# Altium schematic sheet RK3568-SOM-Eth.SchDoc: Ethernet PHY with RJ45 connector
size A2; Date: Not used; ApprovedBy: Not used; CheckedBy: Not used; Author: Not used; CompanyName: STMicroelectronics; DrawnBy: Not used; Engineer: Not used; Organization: Not used; Address1: Not used; Address2: Not used; Address3: Not used; Address4: Not used; DocumentNumber: 6; Revision: Not used; SheetNumber: 6; SheetTotal: 9; Time: Not used; ImagePath: Not used; Application_BuildNumber: Not used
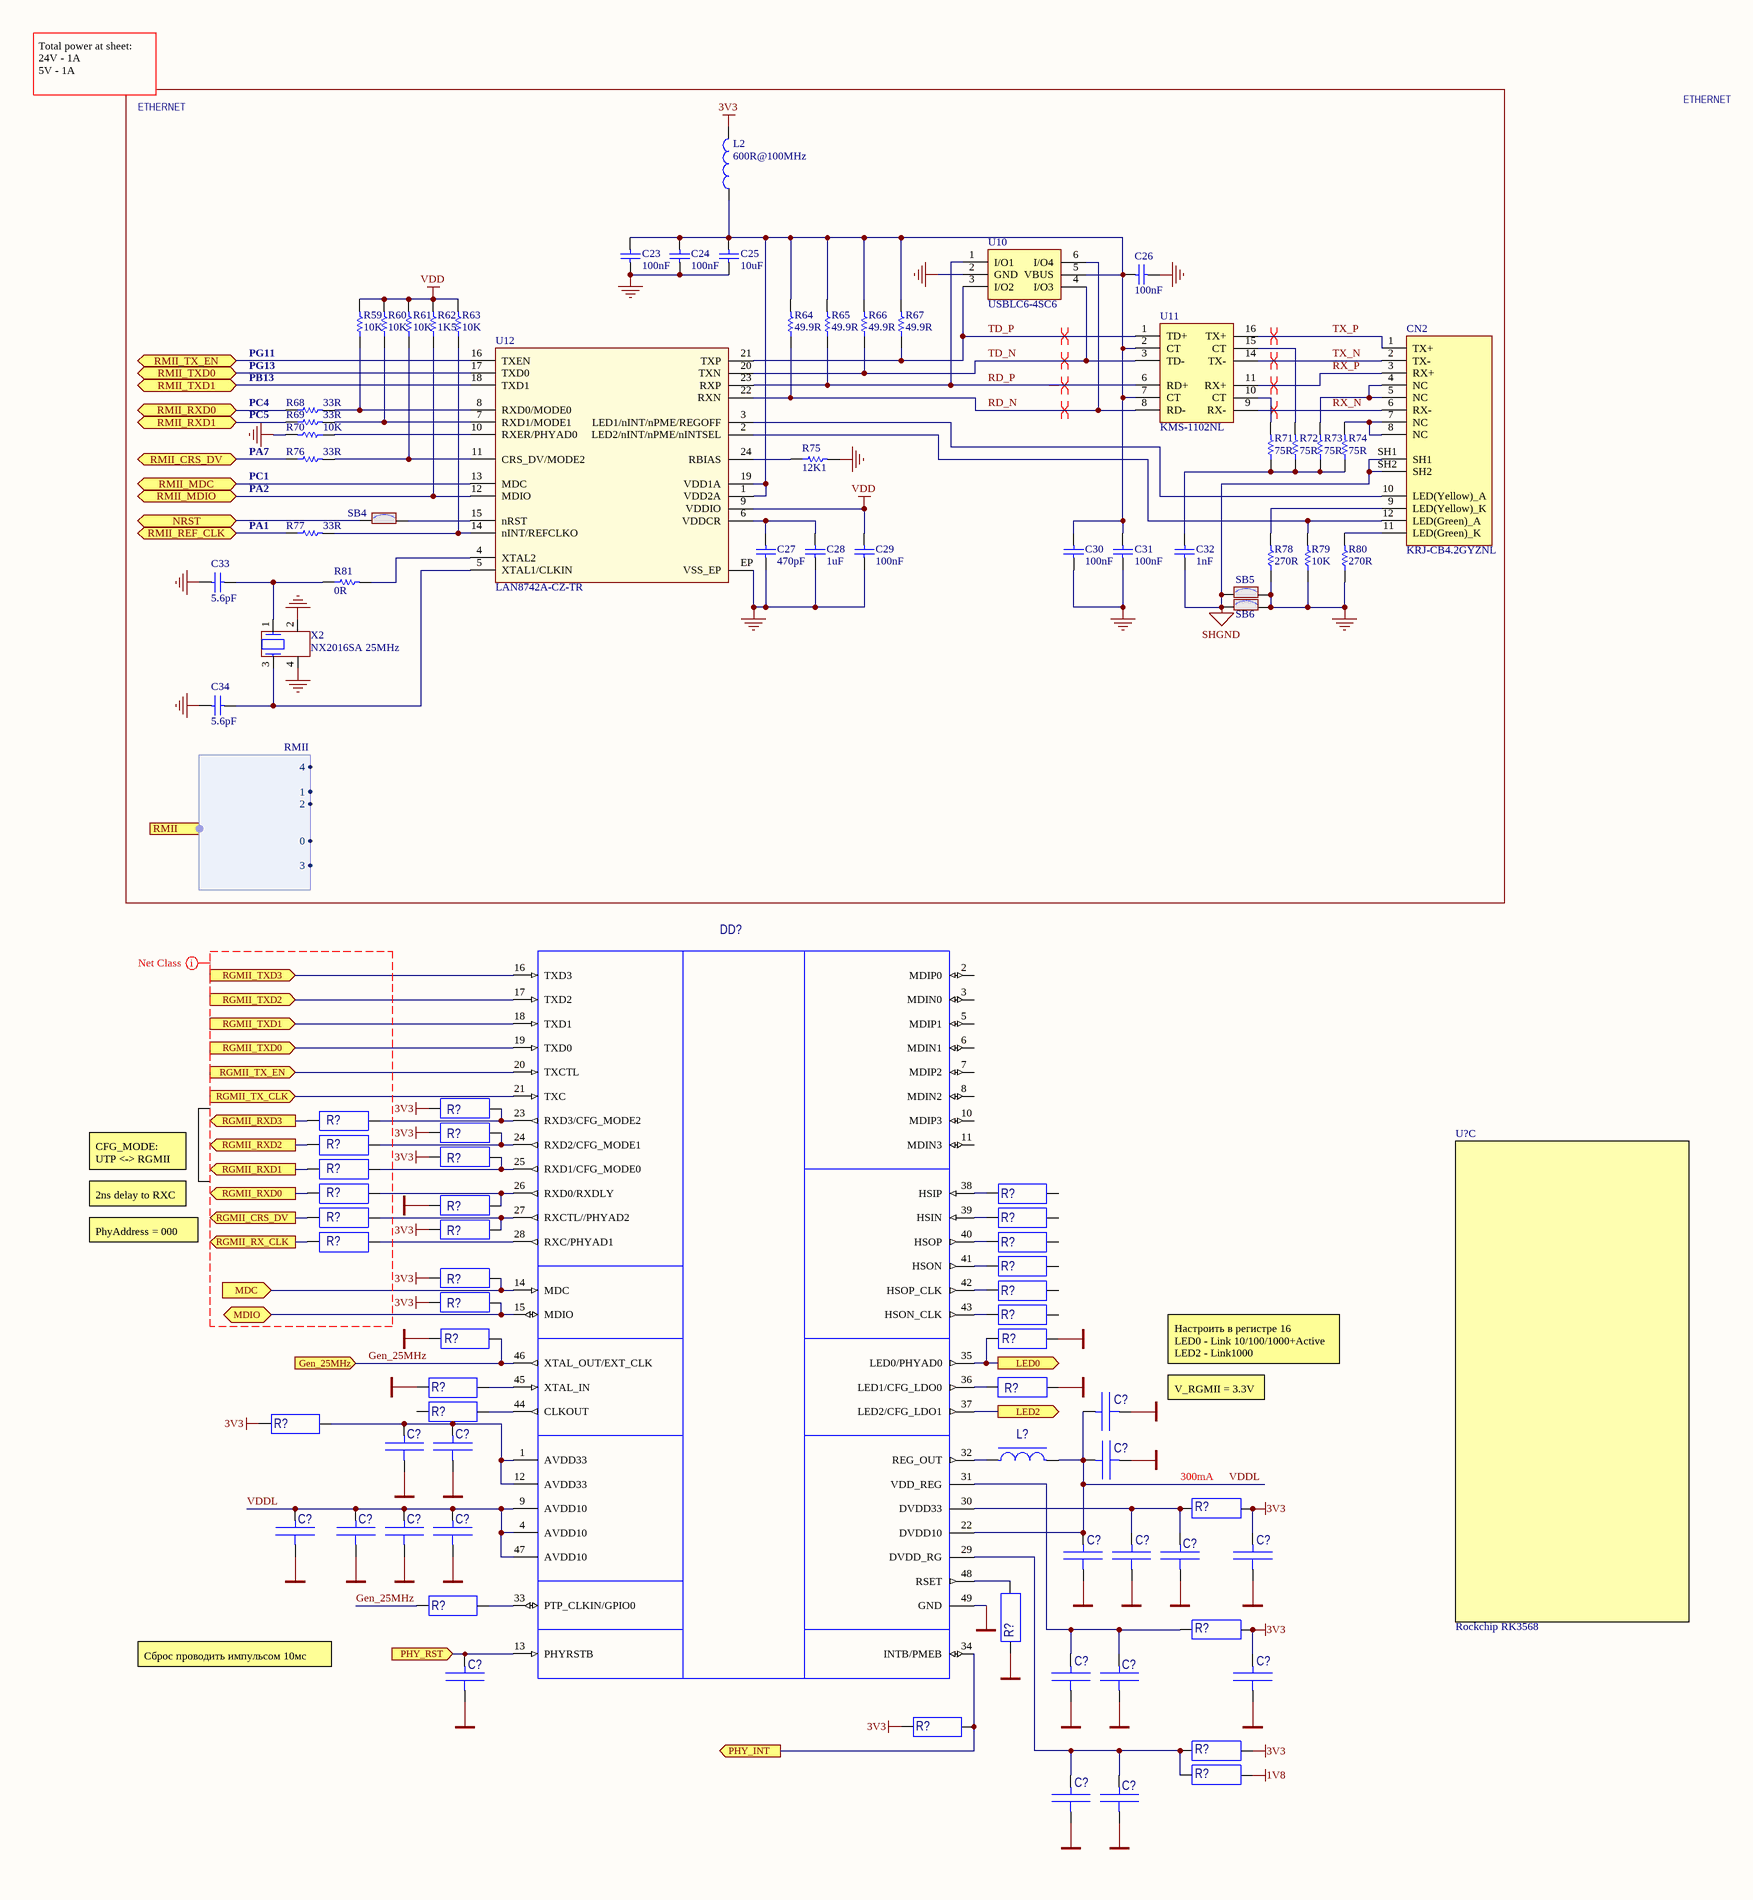
[diagram p0: RK3568-SOM-Eth.SchDoc, left]
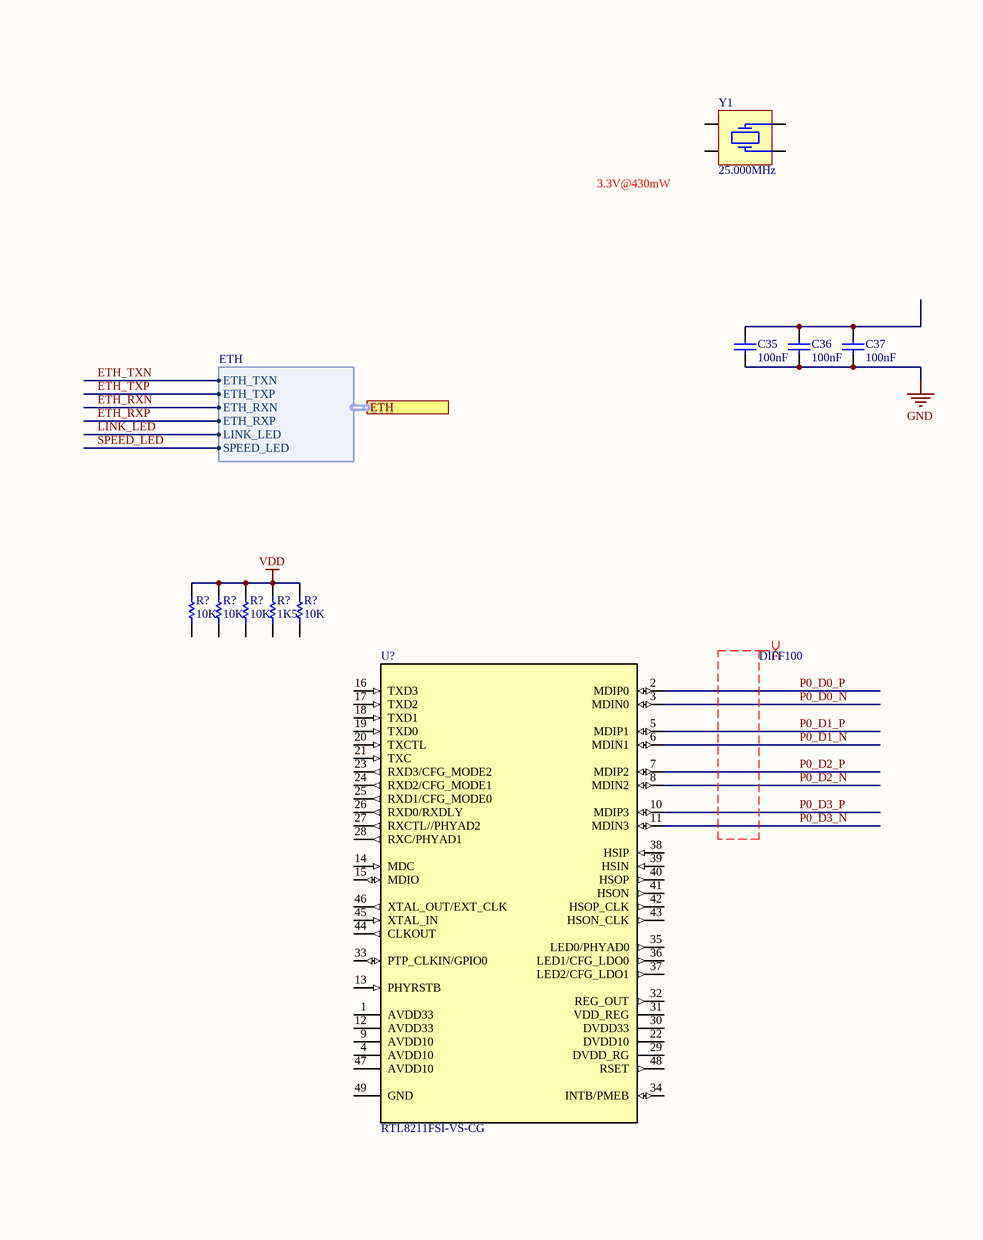
[diagram p1: RK3568-SOM-Eth.SchDoc, right]

## Parts
(Parts that share a designator on the sheet are numbered #1, #2 ... from top to bottom, then left to right.)
C23  value 100nF  [C0603]  (hidden comment: Capacitor)
C24  value 100nF  [C0603]  (hidden comment: Capacitor)
C25  value 10uF  [C0603]  (hidden comment: Capacitor)
C26  value 100nF  [C0603]  (hidden comment: Capacitor)
C27  value 470pF  [C0402]  (hidden comment: Capacitor)
C28  value 1uF  [C0402]  (hidden comment: Capacitor)
C29  value 100nF  [C0603]  (hidden comment: Capacitor)
C30  value 100nF  [C0603]  (hidden comment: Capacitor)
C31  value 100nF  [C0603]  (hidden comment: Capacitor)
C32  value 1nF  [C1206_H1P6]  (hidden comment: Capacitor)
C33  value 5.6pF  [C0402]  (hidden comment: Capacitor)
C34  value 5.6pF  [C0402]  (hidden comment: Capacitor)
C35  value 100nF  [C0603]  (hidden comment: Capacitor)
C36  value 100nF  [C0603]  (hidden comment: Capacitor)
C37  value 100nF  [C0603]  (hidden comment: Capacitor)
C?#1  C0805-16В-4,7мкФ-10%-X7R (CCTC, TCC0805X7R475K160FT)  [CC0805-KL]  (value not drawn)
C?#2  C0402-16В-0,1мкФ-10%-X7R (CCTC, TCC0402X7R104K160AT)  [C0402]  (value not drawn)
C?#3  C0402-16В-0,1мкФ-10%-X7R (CCTC, TCC0402X7R104K160AT)  [C0402]  (value not drawn)
C?#4  C0402-16В-0,1мкФ-10%-X7R (CCTC, TCC0402X7R104K160AT)  [C0402]  (value not drawn)
C?#5  C0603-25В-1,0мкФ-10%-X7R (CCTC, TCC0603X7R105K250CT)  [CC0603-KL]  (value not drawn)
C?#6  C0402-16В-0,1мкФ-10%-X7R (CCTC, TCC0402X7R104K160AT)  [C0402]  (value not drawn)
C?#7  C0402-16В-0,1мкФ-10%-X7R (CCTC, TCC0402X7R104K160AT)  [C0402]  (value not drawn)
C?#8  C0402-16В-0,1мкФ-10%-X7R (CCTC, TCC0402X7R104K160AT)  [C0402]  (value not drawn)
C?#9  C0402-16В-0,1мкФ-10%-X7R (CCTC, TCC0402X7R104K160AT)  [C0402]  (value not drawn)
C?#10  C0402-16В-0,1мкФ-10%-X7R (CCTC, TCC0402X7R104K160AT)  [C0402]  (value not drawn)
C?#11  C0603-25В-1,0мкФ-10%-X7R (CCTC, TCC0603X7R105K250CT)  [CC0603-KL]  (value not drawn)
C?#12  C0402-16В-0,1мкФ-10%-X7R (CCTC, TCC0402X7R104K160AT)  [C0402]  (value not drawn)
C?#13  C0402-16В-0,1мкФ-10%-X7R (CCTC, TCC0402X7R104K160AT)  [C0402]  (value not drawn)
C?#14  C0402-16В-0,1мкФ-10%-X7R (CCTC, TCC0402X7R104K160AT)  [C0402]  (value not drawn)
C?#15  C0603-25В-1,0мкФ-10%-X7R (CCTC, TCC0603X7R105K250CT)  [CC0603-KL]  (value not drawn)
C?#16  C0402-16В-0,1мкФ-10%-X7R (CCTC, TCC0402X7R104K160AT)  [C0402]  (value not drawn)
C?#17  C0402-16В-0,1мкФ-10%-X7R (CCTC, TCC0402X7R104K160AT)  [C0402]  (value not drawn)
C?#18  C0603-25В-1,0мкФ-10%-X7R (CCTC, TCC0603X7R105K250CT)  [CC0603-KL]  (value not drawn)
CN2  value KRJ-CB4.2GYZNL  [CON_RJ45_DGKYD_KRJ-CB4.2GYZNL]  (hidden comment: RJ45_KRJ-CB4.2GYZNL)
DD?  RTL8211FSI-VS-CG (REALTEK, QFN-48)  [QFN40P600X600X100-with_vias]  (value not drawn)
L2  value 600R@100MHz  [L0603]  (hidden comment: BEAD)
L?  L1210-2,2мкГн-20%-3,6А-75мОм (3Lcoils, LHP322512-2R2M)  [IND3225X135]  (value not drawn)
R59  value 10K  [R0402]  (hidden comment: Resistor)
R60  value 10K  [R0402]  (hidden comment: Resistor)
R61  value 10K  [R0402]  (hidden comment: Resistor)
R62  value 1K5  [R0402]  (hidden comment: Resistor)
R63  value 10K  [R0402]  (hidden comment: Resistor)
R64  value 49.9R  [R0402]  (hidden comment: Resistor)
R65  value 49.9R  [R0402]  (hidden comment: Resistor)
R66  value 49.9R  [R0402]  (hidden comment: Resistor)
R67  value 49.9R  [R0402]  (hidden comment: Resistor)
R68  value 33R  [R0402]  (hidden comment: Resistor)
R69  value 33R  [R0402]  (hidden comment: Resistor)
R70  value 10K  [R0402]  (hidden comment: Resistor)
R71  value 75R  [R0402]  (hidden comment: Resistor)
R72  value 75R  [R0402]  (hidden comment: Resistor)
R73  value 75R  [R0402]  (hidden comment: Resistor)
R74  value 75R  [R0402]  (hidden comment: Resistor)
R75  value 12K1  [R0402]  (hidden comment: Resistor)
R76  value 33R  [R0402]  (hidden comment: Resistor)
R77  value 33R  [R0402]  (hidden comment: Resistor)
R78  value 270R  [R0402]  (hidden comment: Resistor)
R79  value 10K  [R0402]  (hidden comment: Resistor)
R80  value 270R  [R0402]  (hidden comment: Resistor)
R81  value 0R  [R0402]  (hidden comment: Resistor)
R?#1  (no value)  [R0402]
R?#2  RC02-22 Ом-1%  [R0402]  (value not drawn)
R?#3  value 10K  [R0402]  (hidden comment: Resistor)
R?#4  value 10K  [R0402]  (hidden comment: Resistor)
R?#5  value 10K  [R0402]  (hidden comment: Resistor)
R?#6  value 1K5  [R0402]  (hidden comment: Resistor)
R?#7  value 10K  [R0402]  (hidden comment: Resistor)
R?#8  (no value)  [R0402]
R?#9  RC02-22 Ом-1%  [R0402]  (value not drawn)
R?#10  (no value)  [R0402]
R?#11  RC02-22 Ом-1%  [R0402]  (value not drawn)
R?#12  RC02-22 Ом-1%  [R0402]  (value not drawn)
R?#13  RC02-0,0 Ом 5%  [R0402]  (value not drawn)
R?#14  (no value)  [R0402]
R?#15  RC02-22 Ом-1%  [R0402]  (value not drawn)
R?#16  RC02-0,0 Ом 5%  [R0402]  (value not drawn)
R?#17  (no value)  [R0402]
R?#18  RC02-22 Ом-1%  [R0402]  (value not drawn)
R?#19  RC02-0,0 Ом 5%  [R0402]  (value not drawn)
R?#20  RC02-0,0 Ом 5%  [R0402]  (value not drawn)
R?#21  RC02-2,0кОм 5%  [R0402]  (value not drawn)
R?#22  RC02-0,0 Ом 5%  [R0402]  (value not drawn)
R?#23  RC02-2,0кОм 5%  [R0402]  (value not drawn)
R?#24  RC02-0,0 Ом 5%  [R0402]  (value not drawn)
R?#25  RC02-4,7кОм 5%  [R0402]  (value not drawn)
R?#26  RC02-4,7кОм 5%  [R0402]  (value not drawn)
R?#27  RC02-0,0 Ом 5%  [R0402]  (value not drawn)
R?#28  RC02-2,0кОм 5%  [R0402]  (value not drawn)
R?#29  (no value)  [R0402]
R?#30  RC02-0,0 Ом 5%  [R0402]  (value not drawn)
R?#31  RC02-0,0 Ом 5%  [R0402]  (value not drawn)
R?#32  (no value)  [R0402]
R?#33  RC02-0,0 Ом 5%  [R0402]  (value not drawn)
R?#34  RC03-2,49кОм 1% (Walsin, WR06X2491FTL)  [RC0603-KL]  (value not drawn)
R?#35  RC02-4,7кОм 5%  [R0402]  (value not drawn)
R?#36  RC02-0,0 Ом 5%  [R0402]  (value not drawn)
R?#37  (no value)  [R0402]
SB4  SB_ON  [SOLDER-BRIDGE_R0603-0R]  (value not drawn)
SB5  SB_ON  [SOLDER-BRIDGE_R0603-0R]  (value not drawn)
SB6  SB_ON  [SOLDER-BRIDGE_R0603-0R]  (value not drawn)
U10  USBLC6-4SC6  [ESD_SOT23-6L]
U11  KMS-1102NL  [TRS_DGKYD_KMS-1102NL]
U12  LAN8742A-CZ-TR  [ICC_VQFN24-EPAD_4X4_P050]
U?#1  PartNumber: RTL8211FSI-VS-CG  [QFN40P600X600X100-with_vias]  (hidden comment: RTL8211FSI-VS-CG (REALTEK, QFN-48))
U?#2  PartNumber: Rockchip RK3568  [ESQ-120-14-G-D]  (hidden comment: *)  (part C of 6)
X2  value NX2016SA 25MHz  [CRY_NX2016SA_4P]  (hidden comment: XTAL_4_PINS)
Y1  25.000MHz  [ABM8G]

## Ports
ETH (harness ETH), Gen_25MHz (in), LED0 (out), LED2 (out), MDC (in), MDIO (bidir), NRST (bidir), PHY_INT (out), PHY_RST (in), RGMII_CRS_DV (out), RGMII_RX_CLK (out), RGMII_RXD0 (out), RGMII_RXD1 (out), RGMII_RXD2 (out), RGMII_RXD3 (out), RGMII_TX_CLK (in), RGMII_TX_EN (in), RGMII_TXD0 (in), RGMII_TXD1 (in), RGMII_TXD2 (in), RGMII_TXD3 (in), RMII (harness RMII), RMII_CRS_DV (bidir), RMII_MDC (bidir), RMII_MDIO (bidir), RMII_REF_CLK (bidir), RMII_RXD0 (bidir), RMII_RXD1 (bidir), RMII_TX_EN (bidir), RMII_TXD0 (bidir), RMII_TXD1 (bidir)

## Harnesses
RMII: 0, 1, 2, 3, 4
ETH: ETH_TXN, ETH_TXP, ETH_RXN, ETH_RXP, LINK_LED, SPEED_LED

## Nets
1V8: R?#37.2
3V3: C?#12.1 C?#16.1 L2.2 R?#1.1 R?#8.1 R?#10.1 R?#17.1 R?#21.1 R?#23.1 R?#30.2 R?#31.2 R?#33.2 R?#35.2 R?#36.2
GND: C23.1 C24.1 C25.1 C26.2 C27.1 C28.1 C29.1 C30.1 C31.1 C33.1 C34.1 C35.1 C36.1 C37.1 C?#1.2 C?#2.2 C?#3.2 C?#4.2 C?#5.2 C?#6.2 C?#7.2 C?#8.2 C?#9.2 C?#10.2 C?#11.2 C?#12.2 C?#13.2 C?#14.2 C?#15.2 C?#16.2 C?#17.2 C?#18.2 DD?.49(GND) R70.2 R75.2 R78.1 R79.1 R80.1 R?#14.1 R?#25.1 R?#26.2 R?#27.2 R?#28.2 R?#34.1 SB5.2 SB6.2 U10.2(GND) U12.EP(VSS_EP) X2.2 X2.4
SHGND: C32.1 CN2.SH1 CN2.SH2 SB5.1 SB6.1
VDD: C29.2 R59.2 R60.2 R61.2 R62.2 R63.2 R?#3.2 R?#4.2 R?#5.2 R?#6.2 R?#7.2 U12.9(VDDIO)
ETH_RXN: port ETH.ETH_RXN
ETH_RXP: port ETH.ETH_RXP
ETH_TXN: port ETH.ETH_TXN
ETH_TXP: port ETH.ETH_TXP
Gen_25MHz: DD?.46(XTAL_OUT/EXT_CLK) R?#25.2 R?#32.2 ; port Gen_25MHz
LED0: DD?.35(LED0/PHYAD0) R?#26.1 ; port LED0
LED2: DD?.37(LED2/CFG_LDO1) ; port LED2
LINK_LED: port ETH.LINK_LED
MDC: DD?.14(MDC) R?#21.2 ; port MDC
MDIO: DD?.15(MDIO) R?#23.2 ; port MDIO
NRST: SB4.1 ; port NRST
P0_D0_N: U?#1.3(MDIN0)
P0_D0_P: U?#1.2(MDIP0)
P0_D1_N: U?#1.6(MDIN1)
P0_D1_P: U?#1.5(MDIP1)
P0_D2_N: U?#1.8(MDIN2)
P0_D2_P: U?#1.7(MDIP2)
P0_D3_N: U?#1.11(MDIN3)
P0_D3_P: U?#1.10(MDIP3)
PHY_INT: DD?.34(INTB/PMEB) R?#35.1 ; port PHY_INT
PHY_RST: C?#13.1 DD?.13(PHYRSTB) ; port PHY_RST
RD_N: R64.1 U10.6(I/O4) U11.8(RD-) U12.22(RXN)
RD_P: R65.1 U10.1(I/O1) U11.6(RD+) U12.23(RXP)
RGMII_CRS_DV: R?#15.2 ; port RGMII_CRS_DV
RGMII_RX_CLK: R?#18.2 ; port RGMII_RX_CLK
RGMII_RXD0: R?#12.2 ; port RGMII_RXD0
RGMII_RXD1: R?#11.2 ; port RGMII_RXD1
RGMII_RXD2: R?#9.2 ; port RGMII_RXD2
RGMII_RXD3: R?#2.2 ; port RGMII_RXD3
RGMII_TX_CLK: DD?.21(TXC) ; port RGMII_TX_CLK
RGMII_TX_EN: DD?.20(TXCTL) ; port RGMII_TX_EN
RGMII_TXD0: DD?.19(TXD0) ; port RGMII_TXD0
RGMII_TXD1: DD?.18(TXD1) ; port RGMII_TXD1
RGMII_TXD2: DD?.17(TXD2) ; port RGMII_TXD2
RGMII_TXD3: DD?.16(TXD3) ; port RGMII_TXD3
RMII_CRS_DV: R76.1 ; port RMII_CRS_DV
RMII_MDC: U12.13(MDC) ; port RMII_MDC
RMII_MDIO: R62.1 U12.12(MDIO) ; port RMII_MDIO
RMII_REF_CLK: R77.1 ; port RMII_REF_CLK
RMII_RXD0: R68.1 ; port RMII_RXD0
RMII_RXD1: R69.1 ; port RMII_RXD1
RMII_TX_EN: U12.16(TXEN) ; port RMII_TX_EN
RMII_TXD0: U12.17(TXD0) ; port RMII_TXD0
RMII_TXD1: U12.18(TXD1) ; port RMII_TXD1
RX_N: CN2.6(RX-) U11.9(RX-)
RX_P: CN2.3(RX+) U11.11(RX+)
SPEED_LED: port ETH.SPEED_LED
TD_N: R66.1 U10.4(I/O3) U11.3(TD-) U12.20(TXN)
TD_P: R67.1 U10.3(I/O2) U11.1(TD+) U12.21(TXP)
TX_N: CN2.2(TX-) U11.14(TX-)
TX_P: CN2.1(TX+) U11.16(TX+)
VDDL: C?#1.1 C?#4.1 C?#5.1 C?#6.1 C?#7.1 C?#8.1 C?#9.1 DD?.4(AVDD10) DD?.9(AVDD10) DD?.22(DVDD10) DD?.47(AVDD10) L?.2
NetC23_2: C23.2 C24.2 C25.2 C26.1 C30.2 C31.2 L2.1 R64.2 R65.2 R66.2 R67.2 U10.5(VBUS) U11.2(CT) U11.7(CT) U12.1(VDD2A) U12.19(VDD1A)
NetC27_2: C27.2 C28.2 U12.6(VDDCR)
NetC32_2: C32.2 R71.1 R72.1 R73.1 R74.1
NetC33_2: C33.2 R81.1 X2.1
NetC34_2: C34.2 U12.5(XTAL1/CLKIN) X2.3
NetC35_2: C35.2 C36.2 C37.2
NetC?#2_1: C?#2.1 C?#3.1 DD?.1(AVDD33) DD?.12(AVDD33) R?#30.1
NetC?#10_1: C?#10.1 C?#11.1 DD?.30(DVDD33) R?#31.1
NetC?#14_1: C?#14.1 C?#15.1 DD?.31(VDD_REG) R?#33.1
NetC?#17_1: C?#17.1 C?#18.1 DD?.29(DVDD_RG) R?#36.1 R?#37.1
NetCN2_4: CN2.4(NC) CN2.5(NC) R73.2
NetCN2_7: CN2.7(NC) CN2.8(NC) R74.2
NetCN2_9: CN2.9(LED(Yellow)_K) R78.2
NetCN2_10: CN2.10(LED(Yellow)_A) U12.3(LED1/nINT/nPME/REGOFF)
NetCN2_11: CN2.11(LED(Green)_K) R80.2
NetCN2_12: CN2.12(LED(Green)_A) R79.2 U12.2(LED2/nINT/nPME/nINTSEL)
NetDD?_23: DD?.23(RXD3/CFG_MODE2) R?#1.2 R?#2.1
NetDD?_24: DD?.24(RXD2/CFG_MODE1) R?#8.2 R?#9.1
NetDD?_25: DD?.25(RXD1/CFG_MODE0) R?#10.2 R?#11.1
NetDD?_26: DD?.26(RXD0/RXDLY) R?#12.1 R?#14.2
NetDD?_27: DD?.27(RXCTL//PHYAD2) R?#15.1 R?#17.2
NetDD?_28: DD?.28(RXC/PHYAD1) R?#18.1
NetDD?_32: DD?.32(REG_OUT) L?.1
NetDD?_33: DD?.33(PTP_CLKIN/GPIO0) R?#32.1
NetDD?_36: DD?.36(LED1/CFG_LDO0) R?#28.1
NetDD?_38: DD?.38(HSIP) R?#13.2
NetDD?_39: DD?.39(HSIN) R?#16.2
NetDD?_40: DD?.40(HSOP) R?#19.2
NetDD?_41: DD?.41(HSON) R?#20.2
NetDD?_42: DD?.42(HSOP_CLK) R?#22.2
NetDD?_43: DD?.43(HSON_CLK) R?#24.2
NetDD?_44: DD?.44(CLKOUT) R?#29.1
NetDD?_45: DD?.45(XTAL_IN) R?#27.1
NetDD?_48: DD?.48(RSET) R?#34.2
NetR59_1: R59.1 R68.2 U12.8(RXD0/MODE0)
NetR60_1: R60.1 R69.2 U12.7(RXD1/MODE1)
NetR61_1: R61.1 R76.2 U12.11(CRS_DV/MODE2)
NetR63_1: R63.1 R77.2 U12.14(nINT/REFCLKO)
NetR70_1: R70.1 U12.10(RXER/PHYAD0)
NetR71_2: R71.2 U11.10(CT)
NetR72_2: R72.2 U11.15(CT)
NetR75_1: R75.1 U12.24(RBIAS)
NetR81_2: R81.2 U12.4(XTAL2)
NetSB4_2: SB4.2 U12.15(nRST)

Not connected (* = marked no-connect by the designer): DD? 2(MDIP0) 3(MDIN0) 5(MDIP1) 6(MDIN1) 7(MDIP2) 8(MDIN2) 10(MDIP3) 11(MDIN3); R?#3 1; R?#4 1; R?#5 1; R?#6 1; R?#7 1; R?#13 1; R?#16 1; R?#19 1; R?#20 1; R?#22 1; R?#24 1; R?#29 2; U?#1 1(AVDD33) 4(AVDD10) 9(AVDD10) 12(AVDD33) 13(PHYRSTB) 14(MDC) 15(MDIO) 16(TXD3) 17(TXD2) 18(TXD1) 19(TXD0) 20(TXCTL) 21(TXC) 22(DVDD10) 23(RXD3/CFG_MODE2) 24(RXD2/CFG_MODE1) 25(RXD1/CFG_MODE0) 26(RXD0/RXDLY) 27(RXCTL//PHYAD2) 28(RXC/PHYAD1) 29(DVDD_RG) 30(DVDD33) 31(VDD_REG) 32(REG_OUT) 33(PTP_CLKIN/GPIO0) 34(INTB/PMEB) 35(LED0/PHYAD0) 36(LED1/CFG_LDO0) 37(LED2/CFG_LDO1) 38(HSIP) 39(HSIN) 40(HSOP) 41(HSON) 42(HSOP_CLK) 43(HSON_CLK) 44(CLKOUT) 45(XTAL_IN) 46(XTAL_OUT/EXT_CLK) 47(AVDD10) 48(RSET) 49(GND); Y1 1 2 3 4

## Layout directives
differential pair: RD_N, RD_P, RX_N, RX_P, TD_N, TD_P, TX_N, TX_P
differential pair; net class DIFF100: (no net found under the mark)
net class SE50: (no net found under the mark)

## Notes on the sheet
- Total power at sheet:
  24V - 1A
  5V - 1A
- ETHERNET
- PG11
- PG13
- PB13
- PC4
- PC5
- PA7
- PC1
- PA2
- (near R77) PA1
- 3.3V@430mW
- CFG_MODE:
  UTP <-> RGMII
- 2ns delay to RXC
- PhyAddress = 000
- Настроить в регистре 16
  LED0 - Link 10/100/1000+Active
  LED2 - Link1000
- V_RGMII = 3.3V
- (near R?#31) 300mA
- Сброс проводить импульсом 10мс
- Title
- Size:
- Date:
- File:
- A2
- Number:
- Time:
- Revision:
- Sheet
- of

## Library data of the parts
C23 C24 C26 C29-C31 = MCD-00237: Capacitor, MLCC, 100nF, 6V3, X5R, 10%, 0603, T=0,8mm; Manufacturer_Part_Number: CC0603KRX5R5BB104; Manufacturer: YAGEO; Provided_By: SUBCO; ECCN_US: EAR99; ECCN_EU: NEC; Internal_Part_Number: MCD-00237; Status: Released; Part_Type: Capacitor; Package: C0603; ComponentLink1Description: Datasheet; ComponentLink1URL: http://tunmcdsvn.tun.st.com/Component_Datasheet_Library/Trunk/Capacitors/Yageo_Multilayer_capacitor_X5R_series_100pF_to_100uF
C25 = MCD-01124: Capacitor, MLCC, 10µF, 10V, X5R, 10%, 0603, T=0.8mm; Manufacturer_Part_Number: GRM188R61A106KAAL; Manufacturer: MURATA; Provided_By: SUBCO; ECCN_US: EAR99; ECCN_EU: NEC; Internal_Part_Number: MCD-01124; Status: Released; Part_Type: Capacitor; Package: C0603; ComponentLink1Description: Datasheet; ComponentLink1URL: http://tunmcdsvn.tun.st.com/Component_Datasheet_Library/Trunk/Capacitors/Murata_Capacitor_GR_series
C27 = MCD-00724: Capacitor, MLCC, 470pF, 50V, NPO, 5%, 0402, T=0,5mm; Manufacturer_Part_Number: CC0402JRNPO9BN471; Manufacturer: YAGEO; Provided_By: SUBCO; Internal_Part_Number: MCD-00724; Status: Released; Part_Type: Capacitor; Package: C0402; ComponentLink1Description: Datasheet; ComponentLink1URL: http://tunmcdsvn.tun.st.com/Component_Datasheet_Library/Trunk/Capacitors/Yageo_Capacitor_NP0_16V-to-50V; ECCN_US: N/A; ECCN_EU: N/A
C28 = MCD-00095: Capacitor, MLCC, 1uF, 6V3, X5R, 10%, 0402, T=0,5mm; Manufacturer_Part_Number: GRM155R61E105KA12; Manufacturer: MURATA; Alternate_Manufacturer_Part_Number: GRM155R60J105KE19; Provided_By: SUBCO; ECCN_US: EAR99; ECCN_EU: NEC; Internal_Part_Number: MCD-00095; Status: Released; Part_Type: Capacitor; Package: C0402; ComponentLink1Description: Datasheet; ComponentLink1URL: http://tunmcdsvn.tun.st.com/Component_Datasheet_Library/Trunk/Capacitors/Murata_Capacitor_GR_series; Alternate_Manufacturer: MURATA
C32 = MCD-00722: Capacitor, MLCC, 1nF, 2KV, X7R, 10%, 1206, T=1,25mm; Manufacturer_Part_Number: CC1206KKX7RDBB102; Manufacturer: YAGEO; Provided_By: SUBCO; Internal_Part_Number: MCD-00722; Status: Released; Part_Type: Capacitor; Package: C1206; ComponentLink1Description: Datasheet; ComponentLink1URL: http://tunmcdsvn.tun.st.com/Component_Datasheet_Library/Trunk/Capacitors/Yageo_Multilayer_Capacitor_NPO_X7R_1KV_to_3KV_10pF_to_33nF/; ECCN_US: N/A; ECCN_EU: N/A
C33 C34 = MCD-01374: Capacitor, MLCC, 5.6pF, 50V, NPO, 5%, 0402, T=0,5mm; Manufacturer_Part_Number: CC0402BRNPO9BN5R6; Manufacturer: YAGEO; Provided_By: SUBCO; Internal_Part_Number: MCD-01374; Status: Released; Part_Type: Capacitor; Package: C0402; ComponentLink1Description: Datasheet; ComponentLink1URL: http://tunmcdsvn.tun.st.com/Component_Datasheet_Library/Trunk/Capacitors/Yageo_Capacitor_NP0_16V-to-50V; ECCN_US: N/A; ECCN_EU: N/A
C35-C37 = Capacitor_1: Capacitor, MLCC, 100nF, 6V3, X5R, 10%, 0603, T=0,8mm; Internal_Part_Number: MCD-00237; Manufacturer_Part_Number: CC0603KRX5R5BB104; Manufacturer: YAGEO; Provided_By: SUBCO; ECCN_US: EAR99; ECCN_EU: NEC; Status: Released; Part_Type: Capacitor; Package: C0603; ComponentLink1Description: Datasheet; ComponentLink1URL: http://tunmcdsvn.tun.st.com/Component_Datasheet_Library/Trunk/Capacitors/Yageo_Multilayer_capacitor_X5R_series_100pF_to_100uF
C?#1 = C0805: Chip Capacitor (MLCC), 0805, Umax=200V, SIZE=2.0x1.3x1.3mm, SMT; Value: C0805-16В-4,7мкФ-10%-X7R (CCTC, TCC0805X7R475K160FT)
C?#2-C?#4 C?#6-C?#10 C?#12-C?#14 C?#16 C?#17 = C0402: Value: C0402-16В-0,1мкФ-10%-X7R (CCTC, TCC0402X7R104K160AT)
C?#5 C?#11 C?#15 C?#18 = C0603: Chip Capacitor (MLCC), 0603, Umax=100V, SIZE=1.6x0.8x0.9mm, SMT; Value: C0603-25В-1,0мкФ-10%-X7R (CCTC, TCC0603X7R105K250CT); Currency: *; Distributor: *; PartNumber: *; HelpURL: *; Manufacturer: *; Volume1: *; Price1: *
CN2 = MCD-00717: RJ45 jack, single port, with LEDS, Metal shielded dip low profile; Part_Type: Connector; Manufacturer: DONGGUAN KEYOUDA ELECTRONIC TECHNOLOGY; Provided_By: SUBCO; Internal_Part_Number: MCD-00717; Status: Released; Manufacturer_Part_Number: KRJ-CB4.2GYZNL; ComponentLink1Description: Datasheet; ComponentLink1URL: http://tunmcdsvn.tun.st.com/Component_Datasheet_Library/Trunk/Connectors/DGKYD_RJ45_KRJ-CB4.2GYZNL; ECCN_US: n/a; ECCN_EU: n/a
DD? U?#1 = RTL8211: Integrated 10/100/1000M Ethernet precision  transceiver. Provides physical layer functions.; Value: RTL8211FSI-VS-CG (REALTEK, QFN-48)
L2 = MCD-00047: SMD Chip ferrite bead, 600R@100MHz +/-25%, 350mA, 500mohm DC, 0603, T=0.8mm; Part_Type: Inductor; Manufacturer_Part_Number: FCM1608KF-601T03; Manufacturer: TAI-TECH; Provided_By: SUBCO; Internal_Part_Number: MCD-00047; Status: Released; ComponentLink1Description: Datasheet; ComponentLink1URL: http://tunmcdsvn.tun.st.com/Component_Datasheet_Library/Trunk/Inductors/TaiTech_Bead_FCM1608_series; ECCN_US: n/a; ECCN_EU: n/a
L? = L1210: Fixed Inductor L1210, SIZE=3.2x2.5x1.2mm; Value: L1210-2,2мкГн-20%-3,6А-75мОм (3Lcoils, LHP322512-2R2M)
R59-R61 R63 R70 R79 R?#3-R?#5 R?#7 = MCD-00053: Resistor,10K,0402,1%,1/16W; Manufacturer_Part_Number: RC0402FR-0710KL; Manufacturer: YAGEO; Provided_By: SUBCO; ECCN_US: EAR99; ECCN_EU: NEC; Internal_Part_Number: MCD-00053; Status: Released; Part_Type: Resistor; Package: R0402; ComponentLink1Description: Datasheet; ComponentLink1URL: http://tunmcdsvn.tun.st.com/Component_Datasheet_Library/Trunk/Resistors/Yageo_Resistor_RC0402-series
R62 R?#6 = MCD-00068: Resistor,1K5,0402,1%,1/16W; Manufacturer_Part_Number: RC0402FR-071K5L; Manufacturer: YAGEO; Provided_By: SUBCO; ECCN_US: EAR99; ECCN_EU: NEC; Internal_Part_Number: MCD-00068; Status: Released; Part_Type: Resistor; Package: R0402; ComponentLink1Description: Datasheet; ComponentLink1URL: http://tunmcdsvn.tun.st.com/Component_Datasheet_Library/Trunk/Resistors/Yageo_Resistor_RC0402-series
R64-R67 = MCD-00565: Resistor,49R9,0402,1%,1/16W; Manufacturer_Part_Number: RC0402FR-0749R9L; Manufacturer: YAGEO; Provided_By: SUBCO; ECCN_US: EAR99; ECCN_EU: NEC; Internal_Part_Number: MCD-00565; Status: Released; Part_Type: Resistor; Package: R0402; ComponentLink1Description: Datasheet; ComponentLink1URL: http://tunmcdsvn.tun.st.com/Component_Datasheet_Library/Trunk/Resistors/Yageo_Resistor_RC0402-series
R68 R69 R76 R77 = MCD-00455: Resistor,33R,0402,1%,1/16W; Manufacturer_Part_Number: RC0402FR-0733RL; Manufacturer: YAGEO; Provided_By: SUBCO; ECCN_US: EAR99; ECCN_EU: NEC; Internal_Part_Number: MCD-00455; Status: Released; Part_Type: Resistor; Package: R0402; ComponentLink1Description: Datasheet; ComponentLink1URL: http://tunmcdsvn.tun.st.com/Component_Datasheet_Library/Trunk/Resistors/Yageo_Resistor_RC0402-series
R71-R74 = MCD-00515: Resistor,75R,0402,1%,1/16W; Manufacturer_Part_Number: RC0402FR-0775RL; Manufacturer: YAGEO; Provided_By: SUBCO; ECCN_US: EAR99; ECCN_EU: NEC; Internal_Part_Number: MCD-00515; Status: Released; Part_Type: Resistor; Package: R0402; ComponentLink1Description: Datasheet; ComponentLink1URL: http://tunmcdsvn.tun.st.com/Component_Datasheet_Library/Trunk/Resistors/Yageo_Resistor_RC0402-series
R75 = MCD-00723: Resistor,12K1,0402,1%,1/16W; Manufacturer_Part_Number: RC0402FR-0712K1L; Manufacturer: YAGEO; Provided_By: SUBCO; ECCN_US: EAR99; ECCN_EU: NEC; Internal_Part_Number: MCD-00723; Status: Released; Part_Type: Resistor; Package: R0402; ComponentLink1Description: Datasheet; ComponentLink1URL: http://tunmcdsvn.tun.st.com/Component_Datasheet_Library/Trunk/Resistors/Yageo_Resistor_RC0402-series
R78 R80 = MCD-00441: Resistor,270R,0402,1%,1/16W; Manufacturer_Part_Number: RC0402FR-07270RL; Manufacturer: YAGEO; Provided_By: SUBCO; ECCN_US: EAR99; ECCN_EU: NEC; Internal_Part_Number: MCD-00441; Status: Released; Part_Type: Resistor; Package: R0402; ComponentLink1Description: Datasheet; ComponentLink1URL: http://tunmcdsvn.tun.st.com/Component_Datasheet_Library/Trunk/Resistors/Yageo_Resistor_RC0402-series
R81 = MCD-00052: Resistor,0R,0402,5%,1/16W; Manufacturer_Part_Number: RC0402JR-070RL; Manufacturer: YAGEO; Provided_By: SUBCO; ECCN_US: EAR99; ECCN_EU: NEC; Internal_Part_Number: MCD-00052; Status: Released; Part_Type: Resistor; Package: R0402; ComponentLink1Description: Datasheet; ComponentLink1URL: http://tunmcdsvn.tun.st.com/Component_Datasheet_Library/Trunk/Resistors/Yageo_Resistor_RC0402-series
R?#1 R?#2 R?#8-R?#33 R?#35-R?#37 = R0402
  R?#2 R?#9 R?#11 R?#12 R?#15 R?#18: Value: RC02-22 Ом-1%
  R?#13 R?#16 R?#19 R?#20 R?#22 R?#24 R?#27 R?#30 R?#31 R?#33 R?#36: Value: RC02-0,0 Ом 5%
  R?#21 R?#23 R?#28: Value: RC02-2,0кОм 5%
  R?#25 R?#26 R?#35: Value: RC02-4,7кОм 5%
R?#34 = RC03: Chip Resistor, 0603, Pmax=0.100W, Umax=50V, SIZE=1.6x0.9x0.5mm, SMT; Value: RC03-2,49кОм 1% (Walsin, WR06X2491FTL); Currency: *; Distributor: *; PartNumber: *; HelpURL: *; Manufacturer: *; Volume1: *; Price1: *
SB4-SB6 = MCD-00071: Solder Bridge ON; Part_Type: Mechanical; Manufacturer_Part_Number: RC0603JR-070RL; Manufacturer: YAGEO; Provided_By: SUBCO; Internal_Part_Number: MCD-00071; Status: Released; ComponentLink1Description: Datasheet; Package: SB0603; ComponentLink1URL: http://tunmcdsvn.tun.st.com/Component_Datasheet_Library/Trunk/Resistors/Yageo_Resistor_RC0603-series; ECCN_US: n/a; ECCN_EU: n/a
U10 = MCD-00250: Very low capacitance ESD protection , 4 lines; Part_Type: IC; Manufacturer: STMICROELECTRONICS; BMS_Part_Number: 9151001; Provided_By: SUBCO with ST control; ECCN_US: EAR99; ECCN_EU: NEC; Internal_Part_Number: MCD-00250; Value: USBLC6-4SC6; Status: Released; Manufacturer_Part_Number: USBLC6-4SC6; ComponentLink1Description: Datasheet; ComponentLink1URL: http://tunmcdsvn.tun.st.com/Component_Datasheet_Library/Trunk/Diodes/STM_ESD_USBLC6-4SC6
U11 = MCD-00718: Discrete Magnetic Transformer Module, 16 pins, SMT, 100 Base-TX; Part_Type: IC; Manufacturer: DONGGUAN KEYOUDA ELECTRONIC TECHNOLOGY; Provided_By: SUBCO; Internal_Part_Number: MCD-00718; Value: KMS-1102NL; Status: Released; Manufacturer_Part_Number: KMS-1102NL; ComponentLink1Description: Datasheet; ComponentLink1URL: http://tunmcdsvn.tun.st.com/Component_Datasheet_Library/Trunk/IC/DGKYD_KMS-1102NL; ECCN_US: n/a; ECCN_EU: n/a
U12 = MCD-00719: 10/100M RMII Ethernet transceiver; Part_Type: IC; Manufacturer: MICROCHIP; Provided_By: SUBCO; Internal_Part_Number: MCD-00719; Value: LAN8742A-CZ-TR; Status: Released; Manufacturer_Part_Number: LAN8742A-CZ-TR; ComponentLink1Description: Datasheet; ComponentLink1URL: http://tunmcdsvn.tun.st.com/Component_Datasheet_Library/Trunk/IC/MICROCHIP_LAN8742A_RMII_PHY; ECCN_US: n/a; ECCN_EU: n/a
U?#2 = RK3568: Rockchip RK3568 Quad-core Cortex-A55, 2.0GHz; Manufacturer: TE Connectivity; Manufacturer Part Number: 1717254-4; Connector Type: Receptacle; Number of Positions: 200; Number of Positions Loaded: All; Pitch: 0.100" (2.54mm); .Creator: MM; Supplier 1: Digi-Key; RoHS: RoHS Compliant; Category: Connectors, Interconnects; Stock 1: 51; Pricing 1: 1=7.42, 10=6.864, 50=6.1586, 100=5.7505, 250=5.00852, 500=4.823, 1000=4.6375, 2500=4.452 (USD); Packaging: Tape & Reel; Contact Type: Female Socket; Number of Rows: 2; Row Spacing: 0.100" (2.54mm); Mounting Type: Through Hole; Termination: Solder; Fastening Type: -; Features: -; Contact Finish: Gold; Contact Finish Thickness: 20µin (0.51µm); Color: Black; ComponentLink1URL: https://wiki.inmys.ru/doku.php?id=wiki:cmp:proc:rockchip-rk3568:start; ComponentLink1Description: DataSheet; Supplier Part Number 1: SAM8767-ND; .Checked PCB: MM; .Checked SCH: MM; Value: *
X2 = MCD-01364: Crystal 25MHz, 6pF, +-20ppm, 80ohms max, SMD; Part_Type: Crystal_Osc; Manufacturer_Part_Number: NX2016SA 25MHz EXS00A-CS11321; Manufacturer: NDK; BMS_Part_Number: 9157044; Provided_By: SUBCO; ECCN_US: EAR99; ECCN_EU: NEC; Internal_Part_Number: MCD-01364; Status: Released; Package: NX2016SA; ComponentLink1Description: Datasheet; ComponentLink1URL: http://tunmcdsvn.tun.st.com/Component_Datasheet_Library/Trunk/Crystal_Osc/NDK_NX2016SA 25MHz EXS00A-CS11321 (EXS10B-28187); Order_Code_Digikey: 644-1367
Y1 = ABM8G-25.000MHZ-18-D2Y-T: CRYSTAL 25MHZ 18PF SMD; Manufacturer: Abracon Corporation; Frequency Stability: ±30ppm; Frequency Tolerance: ±20ppm; ESR (Equivalent Series Resistance): 60 Ohm; Operating Mode: Fundamental; .Checked PCB: MM; Supplier 1: Digi-Key; Manufacturer Part Number: ABM8G-25.000MHZ-18-D2Y-T; RoHS: RoHS Compliant; Category: Crystals and Oscillators; Stock 1: 25549; Pricing 1: 1=1.06, 10=0.944, 50=0.8814, 100=0.78, 500=0.7371 (USD); Packaging: Cut Tape (CT); Type: MHz Crystal; Frequency: 25MHz; Load Capacitance: 18pF; Operating Temperature: -40°C ~ 85°C; Ratings: -; Mounting Type: Surface Mount; Package / Case: 4-SMD, No Lead (DFN, LCC); Size / Dimension: 0.126" L x 0.098" W (3.20mm x 2.50mm); Height: 0.039" (1.00mm); ComponentLink1URL: http://www.abracon.com/Resonators/ABM8G.pdf; ComponentLink1Description: http://www.abracon.com/Resonators/ABM8G.pdf; Supplier Part Number 1: 535-10275-1-ND; .Checked SCH: MM; .Creator: MM